# EAGLE schematic sequencer-eurocard (EAGLE 5.11)

## Sheet 1 of 2
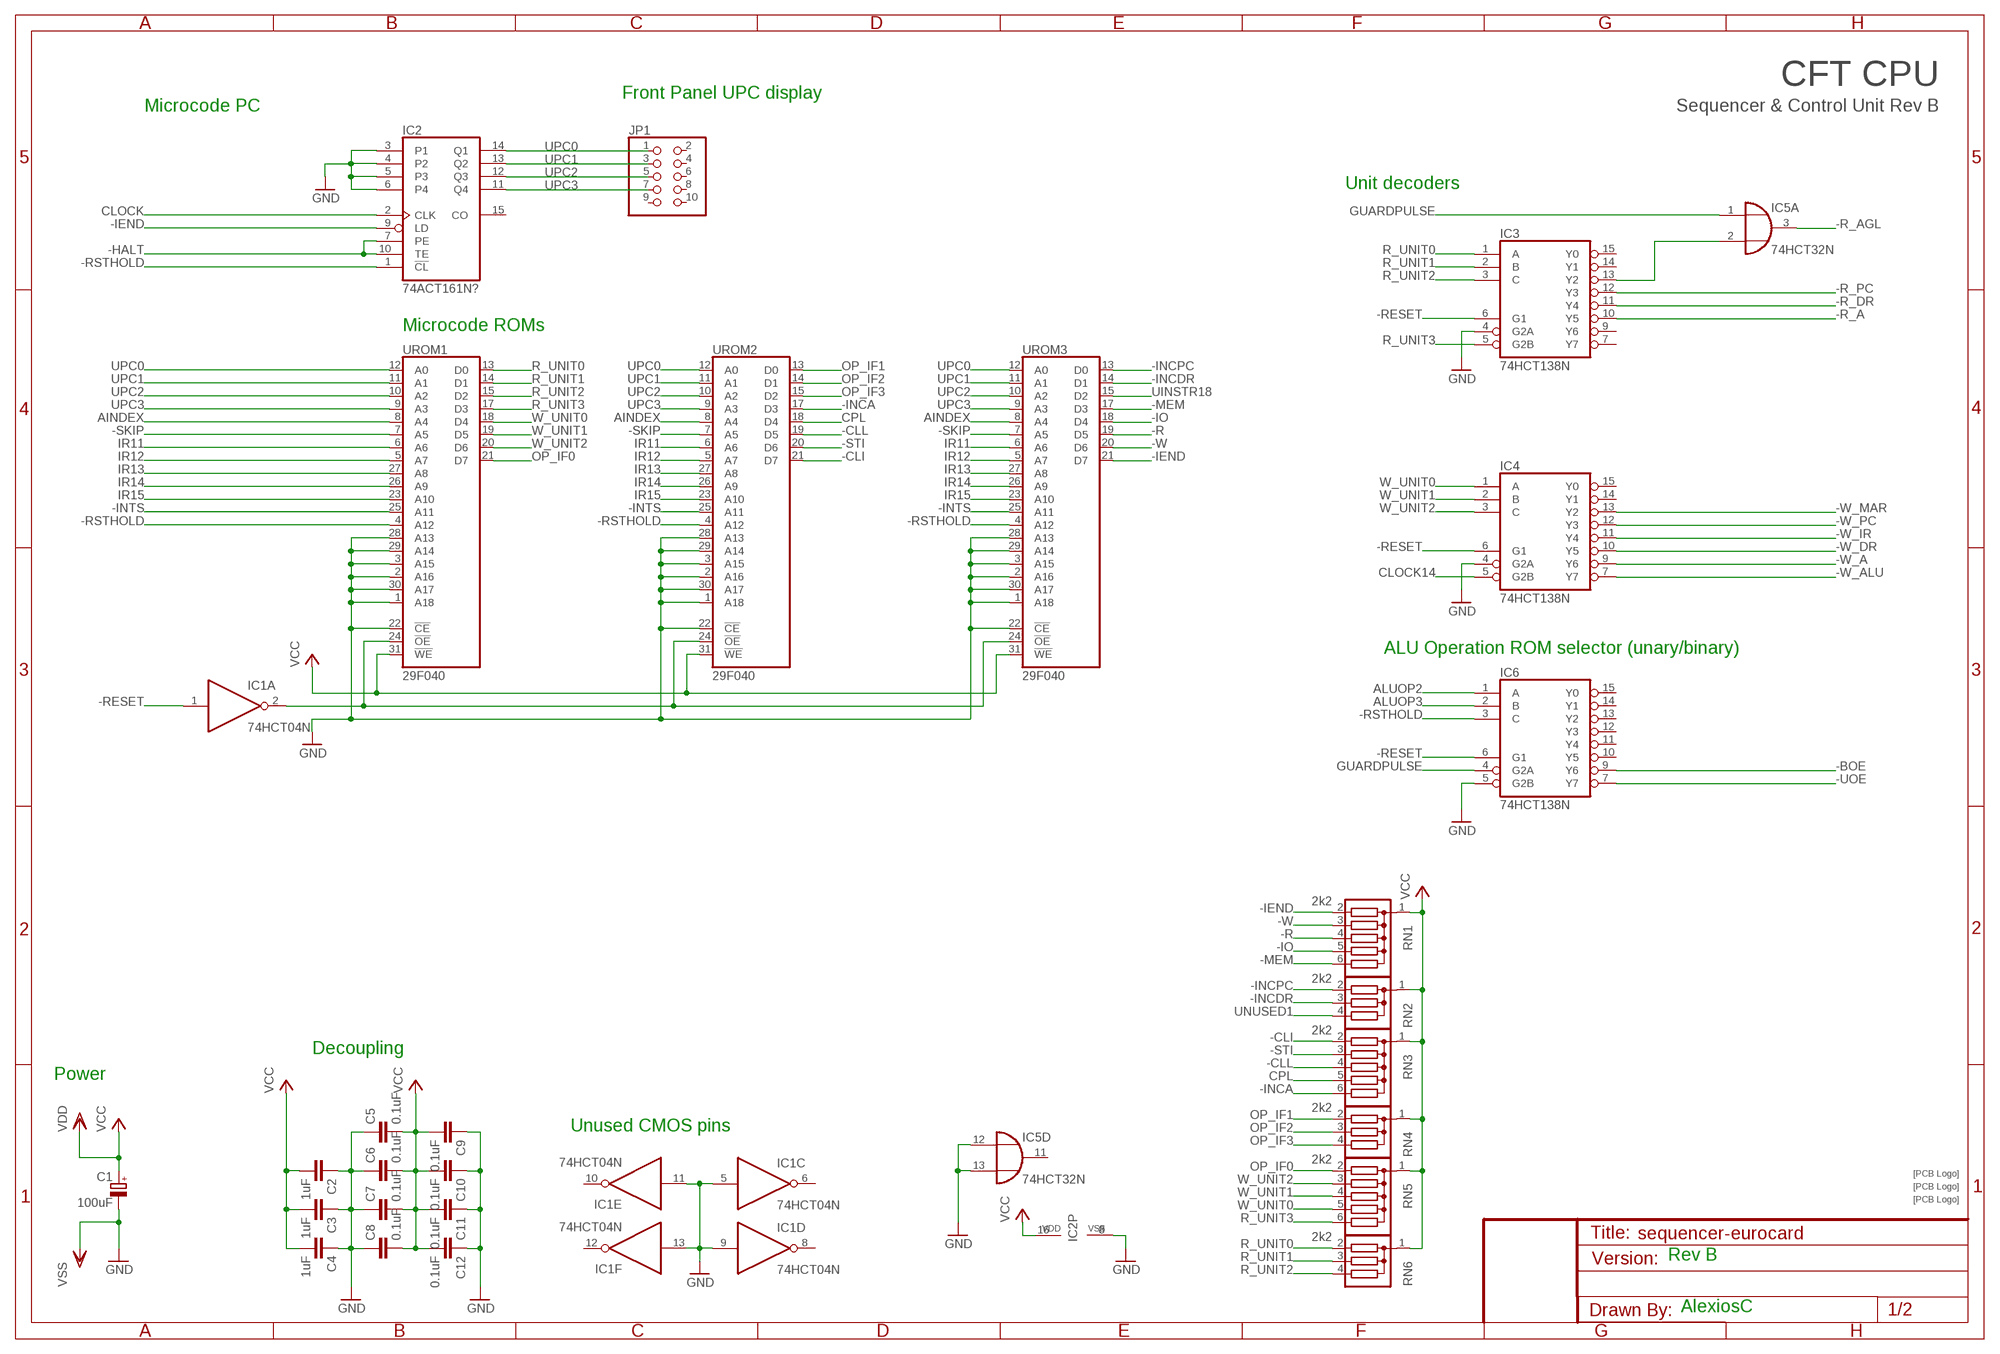
[diagram p0: schematic, sheet 1]

### Parts
C1  100uF  CPOL-EUE2.5-6  [E2,5-6]
C2  1uF  C-EU025-025X050  [C025-025X050]
C3  1uF  C-EU025-025X050  [C025-025X050]
C4  1uF  C-EU025-025X050  [C025-025X050]
C5  0.1uF  C-EU025-025X050  [C025-025X050]
C6  0.1uF  C-EU025-025X050  [C025-025X050]
C7  0.1uF  C-EU025-025X050  [C025-025X050]
C8  0.1uF  C-EU025-025X050  [C025-025X050]
C9  0.1uF  C-EU025-025X050  [C025-025X050]
C10  0.1uF  C-EU025-025X050  [C025-025X050]
C11  0.1uF  C-EU025-025X050  [C025-025X050]
C12  0.1uF  C-EU025-025X050  [C025-025X050]
IC1  74HCT04N  [DIL14]
IC2  74ACT161N?  4161P  [DIL16]
IC3  74HCT138N  [DIL16]
IC4  74HCT138N  [DIL16]
IC5  74HCT32N  [DIL14]
IC6  74HCT138N  [DIL16]
JP1  PINHD-2X5/90  [2X05/90]
RN1  2k2  G05R  [SIL6]
RN2  2k2  G03R  [SIL4]
RN3  2k2  G05R  [SIL6]
RN4  2k2  G03R  [SIL4]
RN5  2k2  G05R  [SIL6]
RN6  2k2  G03R  [SIL4]
U$1  SIGNATUREPLANE  [SIGNATURE_PLANE]
U$2  SIGNATUREPLANE  [SIGNATURE_PLANE]
U$3  SIGNATURESILK  [SIGNATURE]
UROM1  29F040  29F040DIP32  [DIL32]
UROM2  29F040  29F040DIP32  [DIL32]
UROM3  29F040  29F040DIP32  [DIL32]

### Nets
-BOE: IC6.9(Y6) ; also sheet 2
-CLI: RN3.2 UROM2.21(D7) ; also sheet 2
-CLL: RN3.4 UROM2.19(D5) ; also sheet 2
-HALT: IC2.7(PE) IC2.10(TE) ; also sheet 2
-IEND: IC2.9(LD) RN1.2 UROM3.21(D7) ; also sheet 2
-INCA: RN3.6 UROM2.17(D3) ; also sheet 2
-INCDR: RN2.3 UROM3.14(D1) ; also sheet 2
-INCPC: RN2.2 UROM3.13(D0) ; also sheet 2
-INTS: UROM1.25(A11) UROM2.25(A11) UROM3.25(A11)
-IO: RN1.5 UROM3.18(D4) ; also sheet 2
-MEM: RN1.6 UROM3.17(D3) ; also sheet 2
-R: RN1.4 UROM3.19(D5) ; also sheet 2
-R_A: IC3.10(Y5) ; also sheet 2
-R_AGL: IC5.3(A:O) ; also sheet 2
-R_DR: IC3.11(Y4) ; also sheet 2
-R_PC: IC3.12(Y3) ; also sheet 2
-RESET: IC1.1(A:I) IC3.6(G1) IC4.6(G1) IC6.6(G1) ; also sheet 2
-RSTHOLD: IC2.1(!CL) IC6.3(C) UROM1.4(A12) UROM2.4(A12) UROM3.4(A12) ; also sheet 2
-SKIP: UROM1.7(A5) UROM2.7(A5) UROM3.7(A5) ; also sheet 2
-STI: RN3.3 UROM2.20(D6) ; also sheet 2
-UOE: IC6.7(Y7) ; also sheet 2
-W: RN1.3 UROM3.20(D6) ; also sheet 2
-W_A: IC4.9(Y6) ; also sheet 2
-W_ALU: IC4.7(Y7) ; also sheet 2
-W_DR: IC4.10(Y5) ; also sheet 2
-W_IR: IC4.11(Y4) ; also sheet 2
-W_MAR: IC4.13(Y2) ; also sheet 2
-W_PC: IC4.12(Y3) ; also sheet 2
AINDEX: UROM1.8(A4) UROM2.8(A4) UROM3.8(A4) ; also sheet 2
ALUOP2: IC6.1(A)
ALUOP3: IC6.2(B)
CLOCK: IC2.2(CLK) ; also sheet 2
CLOCK14: IC4.5(G2B) ; also sheet 2
CPL: RN3.5 UROM2.18(D4) ; also sheet 2
GND [Power]: C1.- C2.1 C3.1 C4.1 C5.1 C6.1 C7.1 C8.1 C9.1 C10.1 C11.1 C12.1 IC1.5(C:I) IC1.9(D:I) IC1.11(E:I) IC1.13(F:I) IC2.3(P1) IC2.4(P2) IC2.5(P3) IC2.6(P4) IC2.8(VSS) IC3.4(G2A) IC4.4(G2A) IC5.12(D:I0) IC5.13(D:I1) IC6.5(G2B) UROM1.1(A18) UROM1.2(A16) UROM1.3(A15) UROM1.22(!CE) UROM1.28(A13) UROM1.29(A14) UROM1.30(A17) UROM2.1(A18) UROM2.2(A16) UROM2.3(A15) UROM2.22(!CE) UROM2.28(A13) UROM2.29(A14) UROM2.30(A17) UROM3.1(A18) UROM3.2(A16) UROM3.3(A15) UROM3.22(!CE) UROM3.28(A13) UROM3.29(A14) UROM3.30(A17) ; supply symbol labelled VSS ; also sheet 2
GUARDPULSE: IC5.1(A:I0) IC6.4(G2A) ; also sheet 2
IR11: UROM1.6(A6) UROM2.6(A6) UROM3.6(A6) ; also sheet 2
IR12: UROM1.5(A7) UROM2.5(A7) UROM3.5(A7) ; also sheet 2
IR13: UROM1.27(A8) UROM2.27(A8) UROM3.27(A8) ; also sheet 2
IR14: UROM1.26(A9) UROM2.26(A9) UROM3.26(A9) ; also sheet 2
IR15: UROM1.23(A10) UROM2.23(A10) UROM3.23(A10) ; also sheet 2
N$1: IC1.2(A:O) UROM1.24(!OE) UROM2.24(!OE) UROM3.24(!OE)
N$3: IC3.13(Y2) IC5.2(A:I1)
OP_IF0: RN5.2 UROM1.21(D7) ; also sheet 2
OP_IF1: RN4.2 UROM2.13(D0) ; also sheet 2
OP_IF2: RN4.3 UROM2.14(D1) ; also sheet 2
OP_IF3: RN4.4 UROM2.15(D2) ; also sheet 2
R_UNIT0: IC3.1(A) RN6.2 UROM1.13(D0) ; also sheet 2
R_UNIT1: IC3.2(B) RN6.3 UROM1.14(D1) ; also sheet 2
R_UNIT2: IC3.3(C) RN6.4 UROM1.15(D2) ; also sheet 2
R_UNIT3: IC3.5(G2B) RN5.6 UROM1.17(D3) ; also sheet 2
UINSTR18: UROM3.15(D2) ; also sheet 2
UNUSED1: RN2.4
UPC0: IC2.14(Q1) JP1.1 UROM1.12(A0) UROM2.12(A0) UROM3.12(A0)
UPC1: IC2.13(Q2) JP1.3 UROM1.11(A1) UROM2.11(A1) UROM3.11(A1)
UPC2: IC2.12(Q3) JP1.5 UROM1.10(A2) UROM2.10(A2) UROM3.10(A2)
UPC3: IC2.11(Q4) JP1.7 UROM1.9(A3) UROM2.9(A3) UROM3.9(A3)
VCC [Power]: C1.+ C2.2 C3.2 C4.2 C5.2 C6.2 C7.2 C8.2 C9.2 C10.2 C11.2 C12.2 IC2.16(VDD) RN1.1 RN2.1 RN3.1 RN4.1 RN5.1 RN6.1 UROM1.31(!WE) UROM2.31(!WE) UROM3.31(!WE) ; supply symbol labelled VDD ; also sheet 2
W_UNIT0: IC4.1(A) RN5.5 UROM1.18(D4)
W_UNIT1: IC4.2(B) RN5.4 UROM1.19(D5)
W_UNIT2: IC4.3(C) RN5.3 UROM1.20(D6)
Unconnected: IC1.3(B:I) IC1.4(B:O) IC1.6(C:O) IC1.8(D:O) IC1.10(E:O) IC1.12(F:O) IC2.15(CO) IC3.7(Y7) IC3.9(Y6) IC3.14(Y1) IC3.15(Y0) IC4.14(Y1) IC4.15(Y0) IC5.4(B:I0) IC5.5(B:I1) IC5.6(B:O) IC5.8(C:O) IC5.9(C:I0) IC5.10(C:I1) IC5.11(D:O) IC6.10(Y5) IC6.11(Y4) IC6.12(Y3) IC6.13(Y2) IC6.14(Y1) IC6.15(Y0) JP1.2 JP1.4 JP1.6 JP1.8 JP1.9 JP1.10

### Notes on the sheet
- CFT CPU
- Front Panel UPC display
- Microcode PC | Sequencer & Control Unit Rev B
- Unit decoders
- Microcode ROMs
- ALU Operation ROM selector (unary/binary)
- Decoupling
- Power
- Unused CMOS pins
- Rev B
- AlexiosC

## Sheet 2 of 2
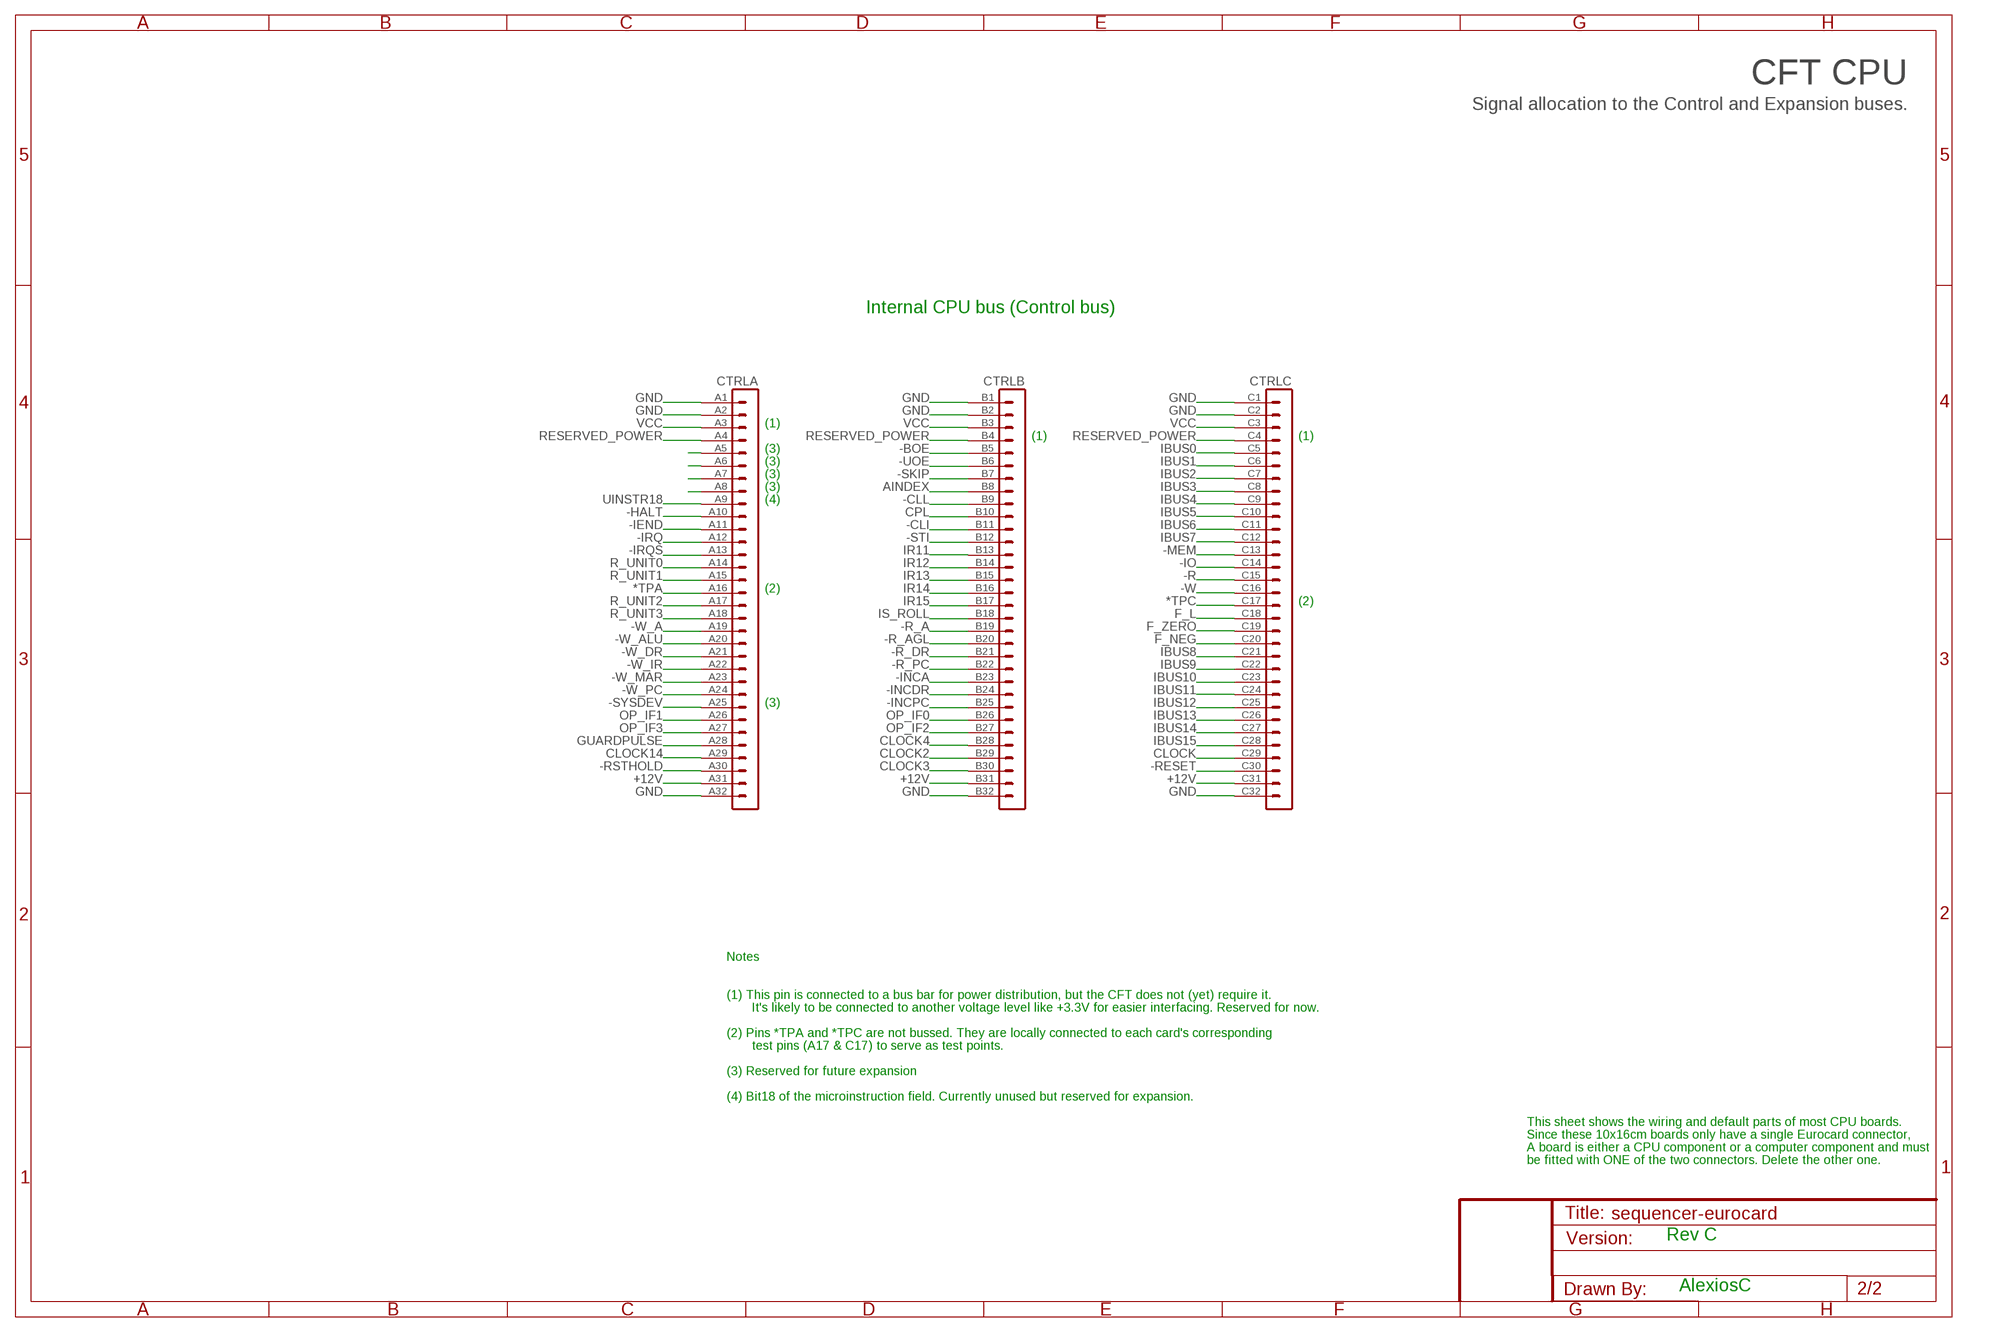
[diagram p1: schematic, sheet 2]

### Parts
CTRL  VG96-3B  [VG96B]

### Nets
*TPA: CTRL.A16
*TPC: CTRL.C17
+12V [12V]: CTRL.A31 CTRL.B31 CTRL.C31
-BOE: CTRL.B5 ; also sheet 1
-CLI: CTRL.B11 ; also sheet 1
-CLL: CTRL.B9 ; also sheet 1
-HALT: CTRL.A10 ; also sheet 1
-IEND: CTRL.A11 ; also sheet 1
-INCA: CTRL.B23 ; also sheet 1
-INCDR: CTRL.B24 ; also sheet 1
-INCPC: CTRL.B25 ; also sheet 1
-IO: CTRL.C14 ; also sheet 1
-IRQ: CTRL.A12
-IRQS: CTRL.A13
-MEM: CTRL.C13 ; also sheet 1
-R: CTRL.C15 ; also sheet 1
-R_A: CTRL.B19 ; also sheet 1
-R_AGL: CTRL.B20 ; also sheet 1
-R_DR: CTRL.B21 ; also sheet 1
-R_PC: CTRL.B22 ; also sheet 1
-RESET: CTRL.C30 ; also sheet 1
-RSTHOLD: CTRL.A30 ; also sheet 1
-SKIP: CTRL.B7 ; also sheet 1
-STI: CTRL.B12 ; also sheet 1
-SYSDEV: CTRL.A25
-UOE: CTRL.B6 ; also sheet 1
-W: CTRL.C16 ; also sheet 1
-W_A: CTRL.A19 ; also sheet 1
-W_ALU: CTRL.A20 ; also sheet 1
-W_DR: CTRL.A21 ; also sheet 1
-W_IR: CTRL.A22 ; also sheet 1
-W_MAR: CTRL.A23 ; also sheet 1
-W_PC: CTRL.A24 ; also sheet 1
AINDEX: CTRL.B8 ; also sheet 1
CLOCK: CTRL.C29 ; also sheet 1
CLOCK2: CTRL.B29
CLOCK3: CTRL.B30
CLOCK4: CTRL.B28
CLOCK14: CTRL.A29 ; also sheet 1
CPL: CTRL.B10 ; also sheet 1
F_L: CTRL.C18
F_NEG: CTRL.C20
F_ZERO: CTRL.C19
GND [Power]: CTRL.A1 CTRL.A2 CTRL.A32 CTRL.B1 CTRL.B2 CTRL.B32 CTRL.C1 CTRL.C2 CTRL.C32 ; also sheet 1
GUARDPULSE: CTRL.A28 ; also sheet 1
IBUS0: CTRL.C5
IBUS1: CTRL.C6
IBUS2: CTRL.C7
IBUS3: CTRL.C8
IBUS4: CTRL.C9
IBUS5: CTRL.C10
IBUS6: CTRL.C11
IBUS7: CTRL.C12
IBUS8: CTRL.C21
IBUS9: CTRL.C22
IBUS10: CTRL.C23
IBUS11: CTRL.C24
IBUS12: CTRL.C25
IBUS13: CTRL.C26
IBUS14: CTRL.C27
IBUS15: CTRL.C28
IR11: CTRL.B13 ; also sheet 1
IR12: CTRL.B14 ; also sheet 1
IR13: CTRL.B15 ; also sheet 1
IR14: CTRL.B16 ; also sheet 1
IR15: CTRL.B17 ; also sheet 1
IS_ROLL: CTRL.B18
N$2: CTRL.A5
N$49: CTRL.A8
N$50: CTRL.A7
N$51: CTRL.A6
OP_IF0: CTRL.B26 ; also sheet 1
OP_IF1: CTRL.A26 ; also sheet 1
OP_IF2: CTRL.B27 ; also sheet 1
OP_IF3: CTRL.A27 ; also sheet 1
R_UNIT0: CTRL.A14 ; also sheet 1
R_UNIT1: CTRL.A15 ; also sheet 1
R_UNIT2: CTRL.A17 ; also sheet 1
R_UNIT3: CTRL.A18 ; also sheet 1
RESERVED_POWER: CTRL.A4 CTRL.B4 CTRL.C4
UINSTR18: CTRL.A9 ; also sheet 1
VCC [Power]: CTRL.A3 CTRL.B3 CTRL.C3 ; also sheet 1

### Notes on the sheet
- CFT CPU
- Signal allocation to the Control and Expansion buses.
- Internal CPU bus (Control bus)
- (1)
- (1) | (1)
- (3)
- (3)
- (3)
- (3)
- (4)
- (2)
- (2)
- (3)
- Notes
- (1) This pin is connected to a bus bar for power distribution, but the CFT does not (yet) require it.
- It's likely to be connected to another voltage level like +3.3V for easier interfacing. Reserved for now.
- (2) Pins *TPA and *TPC are not bussed. They are locally connected to each card's corresponding
- test pins (A17 & C17) to serve as test points.
- (3) Reserved for future expansion
- (4) Bit18 of the microinstruction field. Currently unused but reserved for expansion.
- This sheet shows the wiring and default parts of most CPU boards.
- Since these 10x16cm boards only have a single Eurocard connector,
- A board is either a CPU component or a computer component and must
- be fitted with ONE of the two connectors. Delete the other one.
- Rev C
- AlexiosC

## Power pins joined to a net without a drawn wire
GND: IC1.7(P:GND) IC3.8(GND) IC4.8(GND) IC5.7(P:GND) IC6.8(GND) UROM1.16(GND) UROM2.16(GND) UROM3.16(GND)
VCC: IC1.14(P:VCC) IC3.16(VCC) IC4.16(VCC) IC5.14(P:VCC) IC6.16(VCC) UROM1.32(VCC) UROM2.32(VCC) UROM3.32(VCC)

## Library data of the parts
C1 = rcl:CPOL-EU: POLARIZED CAPACITOR, European symbol
C2-C12 = rcl:C-EU: CAPACITOR, European symbol
CTRL = 19inch:VG96-3: PCB EUROCARD, 96-pin type C/ABC, 2.54 mm
IC1 = 74xx-eu:74*04: Hex INVERTER
IC2 = 41xx:4161: 41xx DEVICE
IC3 IC4 IC6 = 74xx-eu:74*138: 3-line to 8-line DECODER/DEMULTIPLEXER
IC5 = 74xx-eu:74*32: Quad 2-input OR gate
JP1 = pinhead:PINHD-2X5: PIN HEADER
RN1 RN3 RN5 = resistor-sil:G05R: SIL RESISTOR; OC_FARNELL: unknown; OC_NEWARK: unknown
RN2 RN4 RN6 = resistor-sil:G03R: SIL RESISTOR; OC_FARNELL: unknown; OC_NEWARK: unknown
U$1-U$3 = alexios:SIGNATURE: Soup signature
UROM1-UROM3 = alexios:29F040: 4-mbit (512x8) Flash memory in a PLCC32 package (with socket). AM29F040 is an example of this.

## Net classes
1 Power: width 0.914 mm, clearance 0.61 mm
2 12V: width 1.016 mm, clearance 1.016 mm